# EAGLE schematic thresholdboard (EAGLE 9.7.0)
CNAME: Student Sensor Board - MSP430FR5994; CREVISION: 3; DESIGNER: Jacob Sorber

## Sheet 1 of 2
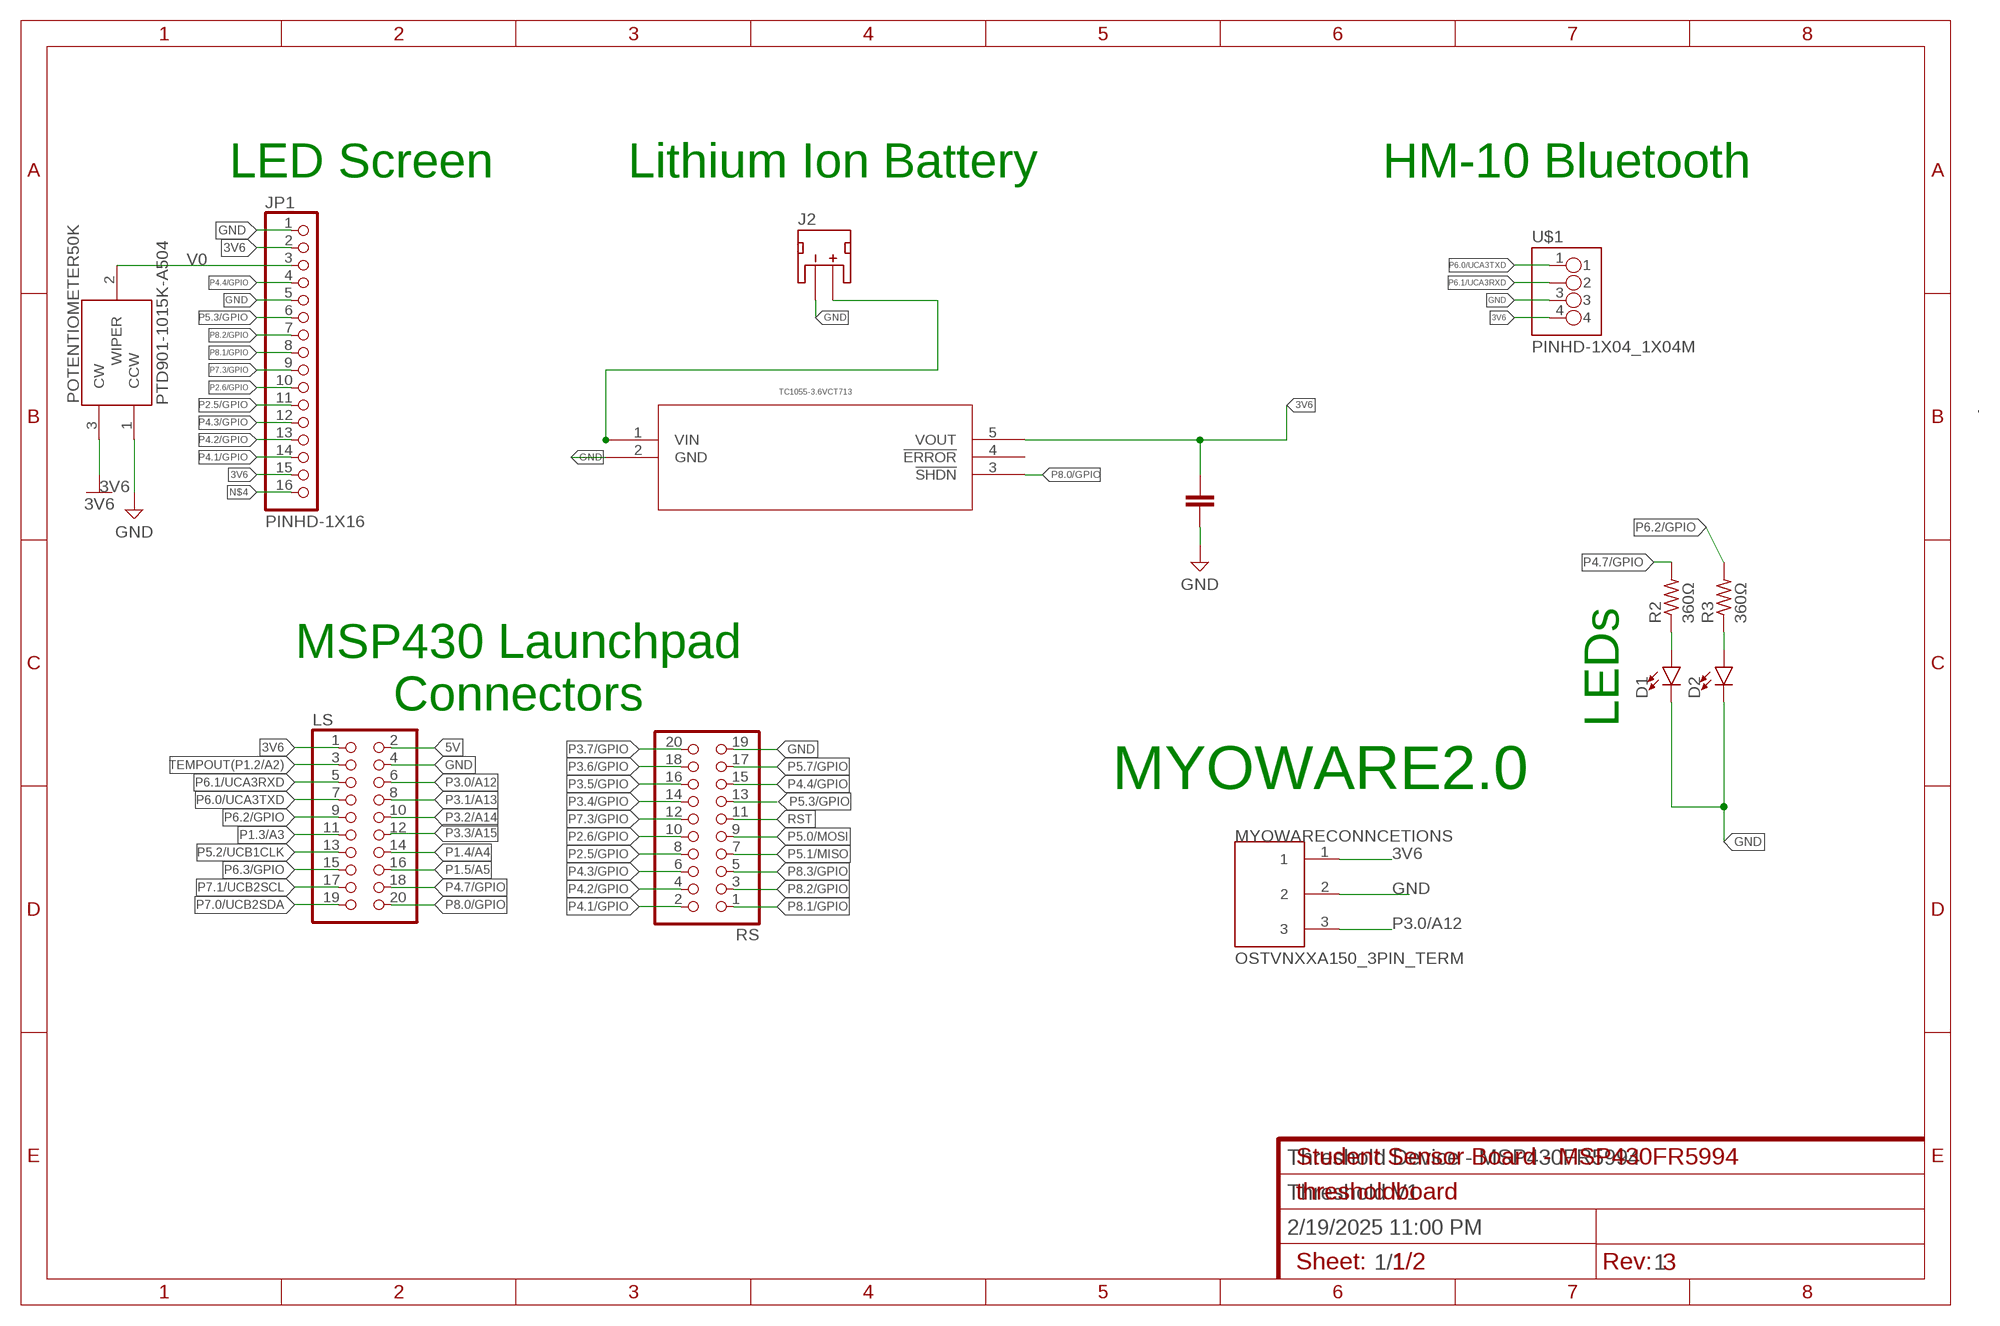
[diagram p0: schematic, sheet 1]

### Parts
C7  C_CHIP-0402(1005-METRIC)  [CAPC1005X60]
D1  LED3MM  [LED_3MM]
D2  LED3MM  [LED_3MM]
J2  JST_2MM_MALE  [JST-2-SMD]
JP1  PINHD-1X16  [1X16]
LS  PINHD-2X10  [2X10]
MYOWARECONNCETIONS  OSTVNXXA150_3PIN_TERM  [OSTVNXXA150]
POTENTIOMETER50K  PTD901-1015K-A504  [PTD9011015KA504]
R2  360Ω  R-US_R0805  [R0805]
R3  360Ω  R-US_R0805  [R0805]
RS  PINHD-2X10  [2X10]
U1  TC1055-3.6VCT713  [SOT-23-5_MC_MCH]
U$1  PINHD-1X04_1X04M  [1X04]

### Nets
3V6: C7.1 JP1.2 JP1.15 LS.1 MYOWARECONNCETIONS.1 POTENTIOMETER50K.3(CW) U1.5(VOUT) U$1.4
5V: LS.2
GND: C7.2 D1.K(C) D2.K(C) J2.1(-) JP1.1 JP1.5 LS.4 MYOWARECONNCETIONS.2 POTENTIOMETER50K.1(CCW) RS.19 U1.2(GND) U$1.3
N$1: D1.A R2.1
N$2: D2.A R3.1
N$4: JP1.16
P1.3/A3: LS.11
P1.4/A4: LS.14
P1.5/A5: LS.16
P2.5/GPIO: JP1.11 RS.8
P2.6/GPIO: JP1.10 RS.10
P3.0/A12: LS.6 MYOWARECONNCETIONS.3
P3.1/A13: LS.8
P3.2/A14: LS.10
P3.3/A15: LS.12
P3.4/GPIO: RS.14
P3.5/GPIO: RS.16
P3.6/GPIO: RS.18
P3.7/GPIO: RS.20
P4.1/GPIO: JP1.14 RS.2
P4.2/GPIO: JP1.13 RS.4
P4.3/GPIO: JP1.12 RS.6
P4.4/GPIO: JP1.4 RS.15
P4.7/GPIO: LS.18 R2.2
P5.0/MOSI: RS.9
P5.1/MISO: RS.7
P5.2/UCB1CLK: LS.13
P5.3/GPIO: JP1.6 RS.13
P5.7/GPIO: RS.17
P6.0/UCA3TXD: LS.7 U$1.1
P6.1/UCA3RXD: LS.5 U$1.2
P6.2/GPIO: LS.9 R3.2
P6.3/GPIO: LS.15
P7.0/UCB2SDA: LS.19
P7.1/UCB2SCL: LS.17
P7.3/GPIO: JP1.9 RS.12
P8.0/GPIO: LS.20 U1.3(!SHDN)
P8.1/GPIO: JP1.8 RS.1
P8.2/GPIO: JP1.7 RS.3
P8.3/GPIO: RS.5
RST: RS.11
TEMPOUT(P1.2/A2): LS.3
V0: JP1.3 POTENTIOMETER50K.2(WIPER)
VIN: J2.2(+) U1.1(VIN)
Unconnected: J2.NC1(PAD1) J2.NC2(PAD2) U1.4(!ERROR)

### Notes on the sheet
- LED Screen | Lithium Ion Battery | HM-10 Bluetooth
- MSP430 Launchpad
  Connectors
- LEDs
- MYOWARE2.0
- Threshold Device - MSP430FR5994
- Threshold V1
- 2/19/2025 11:00 PM
- 1/1 | 1

## Sheet 2 of 2

## Library data of the parts
C7 = Capacitor:C: Capacitor - Generic; CATEGORY: Capacitor; PACKAGE_SIZE: 0402; PACKAGE_TYPE: SMD; SUBCATEGORY: Ceramic Capacitors; TYPE: MLCC
D1 D2 = SparkFun-LED:LED: LED (Generic) Standard schematic elements and footprints for 5mm, 3mm, 1206, and 0603 sized LEDs. Generic LEDs with no color specified.; PROD_ID: DIO-08794
J2 = SparkFun-Connectors:JST_2MM_MALE: JST 2MM MALE RA CONNECTOR Two pin, compact surface mount connector. Commonly used as a battery input connection point. We really like the solid locking feeling and high current rating on these small connectors. We use these all the time as battery connectors. Mates to single-cell LiPo batteries. Here is the connector we sell at SparkFun: JST Right Angle Connector - White <https://www.sparkfun.com/products/8612> (PRT-08612) Datasheet <http://www.sparkfun.com/datasheets/Prototyping/Connectors/JST-Horizontal.pdf> It was used on these SparkFun products: SparkFun MOSFET Power Controller <https://www.sparkfun.com/products/11214> (PRT-11214) SparkFun Battery Babysitter - LiPo Battery Manager <https://www.sparkfun.com/products/13777> (PRT-13777) And many, many others that required a lipo battery connection.; PROD_ID: CONN-11443; SF_ID: PRT-08612
JP1 = Connector:PINHD-1X16: PIN HEADER; CATEGORY: Headers; DESCRIPTION: Header-Straight-16 Position; PACKAGE_TYPE: THT; PITCH: 0.100" (2.54mm); SUBCATEGORY: Headers-Male Pins; TYPE: Board to Board or Cable-Unshrouded-Through Hole-Straight
LS RS = pinhead:PINHD-2X10: PIN HEADER
MYOWARECONNCETIONS = PulseOximeterECG_AU:OSTVNXXA150_3PIN_TERM: 3-Pin Terminal Block 0.1" Centers 6A capacity
POTENTIOMETER50K = F1-Steeringwheel:PTD901-1015K-A504: PTD90 Series - 9 mm Multi-Ganged Potentiometer Source: Datasheet <https://www.mouser.co.uk/datasheet/2/54/ptd90-777943.pdf>; DESCRIPTION: PTD90 Series - 9 mm Multi-Ganged Potentiometer; HEIGHT: 11.6mm; MANUFACTURER_NAME: Bourns; MANUFACTURER_PART_NUMBER: PTD901-1015K-A504; MOUSER_PART_NUMBER: 652-PTD901-1015KA504; MOUSER_PRICE-STOCK: https://www.mouser.co.uk/ProductDetail/Bourns/PTD901-1015K-A504?qs=pxDZlBjcsCjzOrwLTKFEOw%3D%3D
R2 R3 = rcl:R-US_: RESISTOR, American symbol; SPICEPREFIX: R
U1 = TC1055:TC1055-3.6VCT713; COPYRIGHT: Copyright (C) 2025 Ultra Librarian. All rights reserved.; MANUFACTURER_PART_NUMBER: TC1055-3.6VCT713; MFR_NAME: Microchip
U$1 = Tinkercad:PINHD-1X04